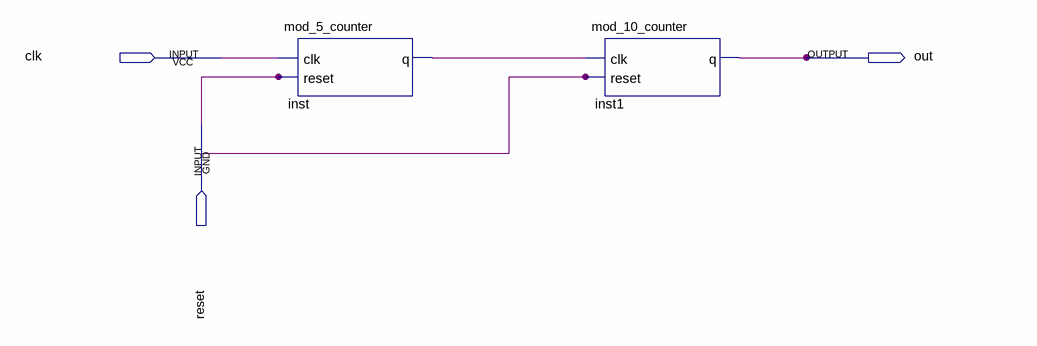
[diagram p0: schematic sheet]
// Quartus schematic clock_by_15.bdf as structural Verilog: 2 symbols, 3 pins
module clock_by_15 (
  input  clk,
  input  reset,
  output out
);

  wire inst_q, undriven;

  mod_5_counter inst (.clk(clk), .reset(reset), .q(inst_q));
  mod_10_counter inst1 (.clk(inst_q), .reset(undriven), .q(out));
endmodule
